# EAGLE design openmv2 (EAGLE 6.1)
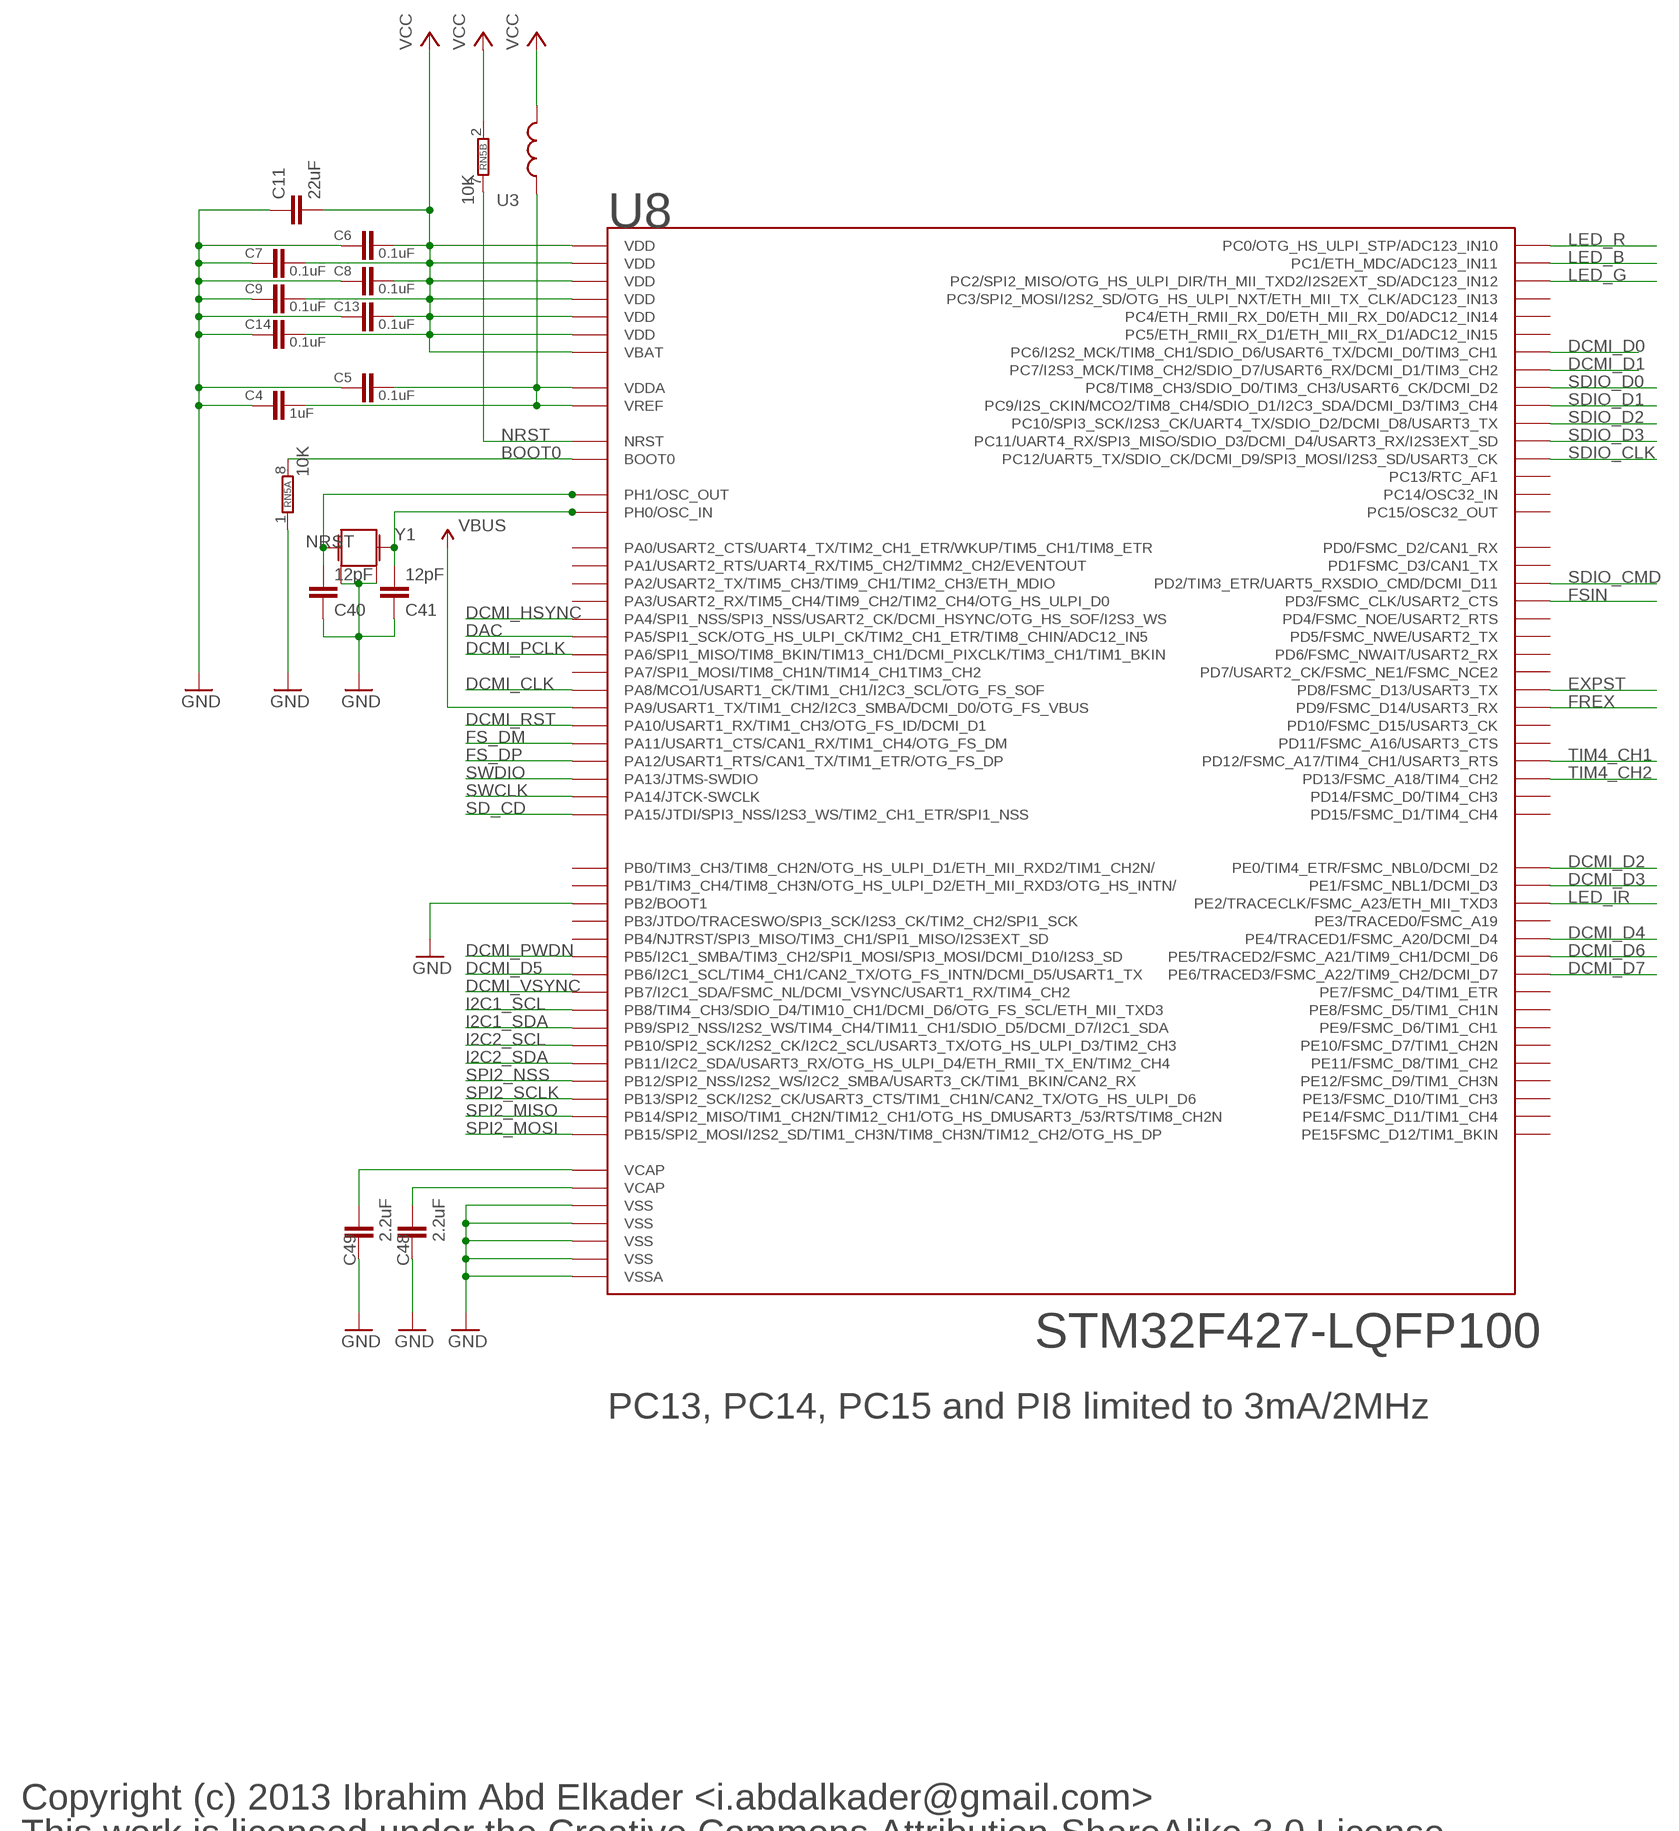
[diagram p0: schematic, sheet 1, part 1 of 2]
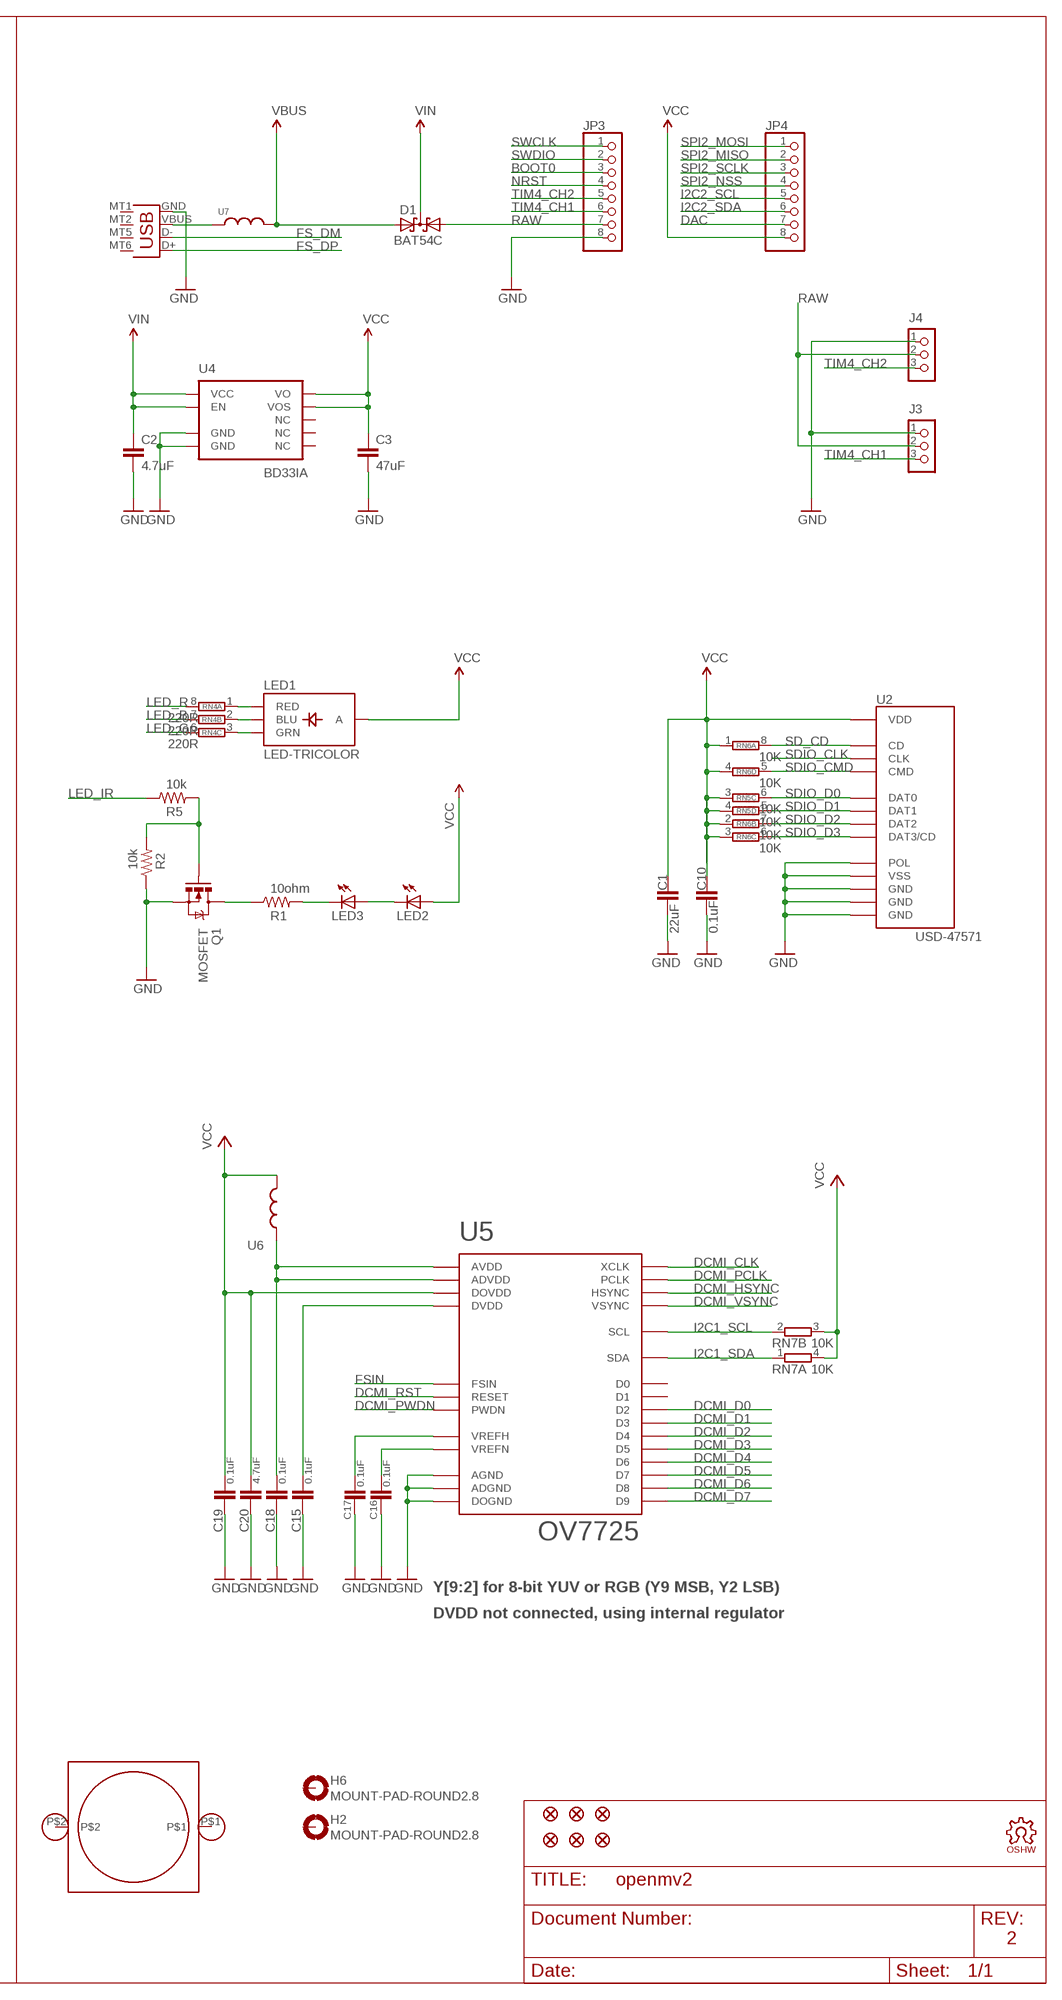
[diagram p1: schematic, sheet 1, part 2 of 2]

## Parts
C1  22uF  CAP0805  [0805]
C2  4.7uF  CAP0603-CAP  [0603-CAP]
C3  47uF  CAP1206  [1206]
C4  1uF  CAP0603-CAP  [0603-CAP]
C5  0.1uF  CAP0603-CAP  [0603-CAP]
C6  0.1uF  CAP0603-CAP  [0603-CAP]
C7  0.1uF  CAP0603-CAP  [0603-CAP]
C8  0.1uF  CAP0603-CAP  [0603-CAP]
C9  0.1uF  CAP0603-CAP  [0603-CAP]
C10  0.1uF  CAP0603-CAP  [0603-CAP]
C11  22uF  CAP0805  [0805]
C13  0.1uF  CAP0603-CAP  [0603-CAP]
C14  0.1uF  CAP0603-CAP  [0603-CAP]
C15  0.1uF  CAP0603-CAP  [0603-CAP]
C16  0.1uF  CAP0603-CAP  [0603-CAP]
C17  0.1uF  CAP0603-CAP  [0603-CAP]
C18  0.1uF  CAP0603-CAP  [0603-CAP]
C19  0.1uF  CAP0603-CAP  [0603-CAP]
C20  4.7uF  CAP0603-CAP  [0603-CAP]
C40  12pF  CAP0603-CAP  [0603-CAP]
C41  12pF  CAP0603-CAP  [0603-CAP]
C48  2.2uF  CAP0603-CAP  [0603-CAP]
C49  2.2uF  CAP0603-CAP  [0603-CAP]
D1  BAT54C  [SOT23]
H2  MOUNT-PAD-ROUND2.8  [2,8-PAD]
H6  MOUNT-PAD-ROUND2.8  [2,8-PAD]
J3  CON_HEADER_1X03  [M1X3_SMD]
J4  CON_HEADER_1X03  [M1X3_SMD]
JP1  FIDUCIAL1X2  [FIDUCIAL-1X2]
JP2  FIDUCIAL1X2  [FIDUCIAL-1X2]
JP3  PINHD-1X8  [1X08]
JP4  PINHD-1X8  [1X08]
JP5  FIDUCIAL1X2  [FIDUCIAL-1X2]
JP6  FIDUCIAL1X2  [FIDUCIAL-1X2]
JP7  FIDUCIAL1X2  [FIDUCIAL-1X2]
JP8  FIDUCIAL1X2  [FIDUCIAL-1X2]
LED1  LED-TRICOLOR  [LED-TRICOLOR-SMD]
LED2  LED3MM  [LED3MM]
LED3  LED3MM  [LED3MM]
LOGO1  OSHW_LOGO_FILLX0150-NT  [OSHW_FILLX150_NOTEXT]
Q1  MOSFET  MOSFET-NCHANNELSMD  [SOT23-3]
R1  10ohm  RESISTOR0603-RES  [0603-RES]
R2  10k  RESISTOR0603-RES  [0603-RES]
R5  10k  RESISTOR0603-RES  [0603-RES]
RN4  220R  4R-NEXBV8V  [EXBV8V]
RN5  10K  4R-NEXBV8V  [EXBV8V]
RN6  10K  4R-NEXBV8V  [EXBV8V]
RN7  10K  2R-NEXBV4V  [EXBV4V]
U1  LENSMOUNT20MM  [LENSMOUNT-20MM]
U2  USD-47571  [USD-47571]
U3  INDUCTOR0603  [0603]
U4  BD33IA  [HTSOP-J8]
U5  OV7725  [CSP2-28]
U6  INDUCTOR0603  [0603]
U7  INDUCTOR0603  [0603]
U8  STM32F427-LQFP100  STM32F407LQFP100  [LQFP100]
X2  USB-MICROB  [USB-MICROB]
Y1  CRYSTAL2.5X2.0  [CRYSTAL-2.5X2.0]

## Nets
BOOT0: JP3.3 RN5.8 U8.94(BOOT0)
DAC: JP4.7 U8.30(PA5/SPI1_SCK/OTG_HS_ULPI_CK/TIM2_CH1_ETR/TIM8_CHIN/ADC12_IN5)
DCMI_CLK: U5.F3(XCLK) U8.67(PA8/MCO1/USART1_CK/TIM1_CH1/I2C3_SCL/OTG_FS_SOF)
DCMI_D0: U5.F5(D2) U8.63(PC6/I2S2_MCK/TIM8_CH1/SDIO_D6/USART6_TX/DCMI_D0/TIM3_CH1)
DCMI_D1: U5.F2(D3) U8.64(PC7/I2S3_MCK/TIM8_CH2/SDIO_D7/USART6_RX/DCMI_D1/TIM3_CH2)
DCMI_D2: U5.D6(D4) U8.97(PE0/TIM4_ETR/FSMC_NBL0/DCMI_D2)
DCMI_D3: U5.D1(D5) U8.98(PE1/FSMC_NBL1/DCMI_D3)
DCMI_D4: U5.E6(D6) U8.3(PE4/TRACED1/FSMC_A20/DCMI_D4)
DCMI_D5: U5.E1(D7) U8.92(PB6/I2C1_SCL/TIM4_CH1/CAN2_TX/OTG_FS_INTN/DCMI_D5/USART1_TX)
DCMI_D6: U5.F6(D8) U8.4(PE5/TRACED2/FSMC_A21/TIM9_CH1/DCMI_D6)
DCMI_D7: U5.F1(D9) U8.5(PE6/TRACED3/FSMC_A22/TIM9_CH2/DCMI_D7)
DCMI_HSYNC: U5.B6(HSYNC) U8.29(PA4/SPI1_NSS/SPI3_NSS/USART2_CK/DCMI_HSYNC/OTG_HS_SOF/I2S3_WS)
DCMI_PCLK: U5.E4(PCLK) U8.31(PA6/SPI1_MISO/TIM8_BKIN/TIM13_CH1/DCMI_PIXCLK/TIM3_CH1/TIM1_BKIN)
DCMI_PWDN: U5.C1(PWDN) U8.91(PB5/I2C1_SMBA/TIM3_CH2/SPI1_MOSI/SPI3_MOSI/DCMI_D10/I2S3_SD)
DCMI_RST: U5.A2(RESET) U8.69(PA10/USART1_RX/TIM1_CH3/OTG_FS_ID/DCMI_D1)
DCMI_VSYNC: U5.C6(VSYNC) U8.93(PB7/I2C1_SDA/FSMC_NL/DCMI_VSYNC/USART1_RX/TIM4_CH2)
EXPST: U8.55(PD8/FSMC_D13/USART3_TX)
FREX: U8.56(PD9/FSMC_D14/USART3_RX)
FS_DM: U8.70(PA11/USART1_CTS/CAN1_RX/TIM1_CH4/OTG_FS_DM) X2.D-
FS_DP: U8.71(PA12/USART1_RTS/CAN1_TX/TIM1_ETR/OTG_FS_DP) X2.D+
FSIN: U5.A4(FSIN) U8.84(PD3/FSMC_CLK/USART2_CTS)
GND: C1.2 C2.2 C3.2 C4.2 C5.2 C6.2 C7.2 C8.2 C9.2 C10.2 C11.1 C13.2 C14.2 C15.2 C16.2 C17.2 C18.2 C19.2 C20.2 C40.1 C41.1 C48.2 C49.2 J3.1 J4.1 JP3.8 Q1.2(S) R2.1 RN5.1 U2.G$1(GND) U2.G$2(GND) U2.G$3(GND) U2.G$4(POL) U2.P$6(VSS) U4.3(GND) U4.P$1(GND) U5.B1(ADGND) U5.B4(AGND) U5.F4(DOGND) U8.10(VSS) U8.20(VSSA) U8.27(VSS) U8.37(PB2/BOOT1) U8.74(VSS) U8.99(VSS) X2.GND Y1.2 Y1.4
I2C1_SCL: RN7.2 U5.A5(SCL) U8.95(PB8/TIM4_CH3/SDIO_D4/TIM10_CH1/DCMI_D6/OTG_FS_SCL/ETH_MII_TXD3)
I2C1_SDA: RN7.1 U5.B5(SDA) U8.96(PB9/SPI2_NSS/I2S2_WS/TIM4_CH4/TIM11_CH1/SDIO_D5/DCMI_D7/I2C1_SDA)
I2C2_SCL: JP4.5 U8.47(PB10/SPI2_SCK/I2S2_CK/I2C2_SCL/USART3_TX/OTG_HS_ULPI_D3/TIM2_CH3)
I2C2_SDA: JP4.6 U8.48(PB11/I2C2_SDA/USART3_RX/OTG_HS_ULPI_D4/ETH_RMII_TX_EN/TIM2_CH4)
LED_B: RN4.7 U8.16(PC1/ETH_MDC/ADC123_IN11)
LED_G: RN4.6 U8.17(PC2/SPI2_MISO/OTG_HS_ULPI_DIR/TH_MII_TXD2/I2S2EXT_SD/ADC123_IN12)
LED_IR: R5.1 U8.1(PE2/TRACECLK/FSMC_A23/ETH_MII_TXD3)
LED_R: RN4.8 U8.15(PC0/OTG_HS_ULPI_STP/ADC123_IN10)
N$1: C17.1 U5.A3(VREFH)
N$2: C40.2 U8.13(PH1/OSC_OUT) Y1.3
N$3: C16.1 U5.B2(VREFN)
N$4: C41.2 U8.12(PH0/OSC_IN) Y1.1
N$5: Q1.1(G) R2.2 R5.2
N$7: U7.1 X2.VBUS
N$8: LED1.R(RED) RN4.1
N$9: LED1.G(GRN) RN4.3
N$10: LED3.K(C) R1.2
N$11: LED1.B(BLU) RN4.2
N$12: C4.1 C5.1 U3.1 U8.21(VREF) U8.22(VDDA)
N$13: C18.1 U5.A1(ADVDD) U5.B3(AVDD) U6.1
N$14: Q1.3(D) R1.1
N$15: C15.1 U5.E3(DVDD)
N$16: LED2.K(C) LED3.A
NRST: JP3.4 RN5.7 U8.14(NRST)
RAW: D1.1(A1) J3.2 J4.2 JP3.7
SD_CD: RN6.8 U2.G$5(CD) U8.77(PA15/JTDI/SPI3_NSS/I2S3_WS/TIM2_CH1_ETR/SPI1_NSS)
SDIO_CLK: U2.P$5(CLK) U8.80(PC12/UART5_TX/SDIO_CK/DCMI_D9/SPI3_MOSI/I2S3_SD/USART3_CK)
SDIO_CMD: RN6.5 U2.P$3(CMD) U8.83(PD2/TIM3_ETR/UART5_RXSDIO_CMD/DCMI_D11)
SDIO_D0: RN5.6 U2.P$7(DAT0) U8.65(PC8/TIM8_CH3/SDIO_D0/TIM3_CH3/USART6_CK/DCMI_D2)
SDIO_D1: RN5.5 U2.P$8(DAT1) U8.66(PC9/I2S_CKIN/MCO2/TIM8_CH4/SDIO_D1/I2C3_SDA/DCMI_D3/TIM3_CH4)
SDIO_D2: RN6.7 U2.P$1(DAT2) U8.78(PC10/SPI3_SCK/I2S3_CK/UART4_TX/SDIO_D2/DCMI_D8/USART3_TX)
SDIO_D3: RN6.6 U2.P$2(DAT3/CD) U8.79(PC11/UART4_RX/SPI3_MISO/SDIO_D3/DCMI_D4/USART3_RX/I2S3EXT_SD)
SPI2_MISO: JP4.2 U8.53(PB14/SPI2_MISO/TIM1_CH2N/TIM12_CH1/OTG_HS_DMUSART3_/53/RTS/TIM8_CH2N)
SPI2_MOSI: JP4.1 U8.54(PB15/SPI2_MOSI/I2S2_SD/TIM1_CH3N/TIM8_CH3N/TIM12_CH2/OTG_HS_DP)
SPI2_NSS: JP4.4 U8.51(PB12/SPI2_NSS/I2S2_WS/I2C2_SMBA/USART3_CK/TIM1_BKIN/CAN2_RX)
SPI2_SCLK: JP4.3 U8.52(PB13/SPI2_SCK/I2S2_CK/USART3_CTS/TIM1_CH1N/CAN2_TX/OTG_HS_ULPI_D6)
SWCLK: JP3.1 U8.76(PA14/JTCK-SWCLK)
SWDIO: JP3.2 U8.72(PA13/JTMS-SWDIO)
TIM4_CH1: J3.3 JP3.6 U8.59(PD12/FSMC_A17/TIM4_CH1/USART3_RTS)
TIM4_CH2: J4.3 JP3.5 U8.60(PD13/FSMC_A18/TIM4_CH2)
VBUS: D1.2(A2) U7.2 U8.68(PA9/USART1_TX/TIM1_CH2/I2C3_SMBA/DCMI_D0/OTG_FS_VBUS)
VCAP1: C49.1 U8.49(VCAP)
VCAP2: C48.1 U8.73(VCAP)
VCC: C1.1 C3.1 C6.1 C7.1 C8.1 C9.1 C10.1 C11.2 C13.1 C14.1 C19.1 C20.1 JP4.8 LED1.A LED2.A RN5.2 RN5.3 RN5.4 RN6.1 RN6.2 RN6.3 RN6.4 RN7.3 RN7.4 U2.P$4(VDD) U3.2 U4.1(VO) U4.2(VOS) U5.E5(DOVDD) U6.2 U8.6(VBAT) U8.11(VDD) U8.19(VDD) U8.28(VDD) U8.50(VDD) U8.75(VDD) U8.100(VDD)
VIN: C2.1 D1.3(CC) U4.5(EN) U4.8(VCC)
Unconnected: H2.B2,8(MOUNT) H6.B2,8(MOUNT) RN4.4 RN4.5 U1.P$1 U1.P$2 U4.4(NC) U4.6(NC) U4.7(NC) U5.A6(D0) U5.E2(D1) U8.2(PE3/TRACED0/FSMC_A19) U8.7(PC13/RTC_AF1) U8.8(PC14/OSC32_IN) U8.9(PC15/OSC32_OUT) U8.18(PC3/SPI2_MOSI/I2S2_SD/OTG_HS_ULPI_NXT/ETH_MII_TX_CLK/ADC123_IN13) U8.23(PA0/USART2_CTS/UART4_TX/TIM2_CH1_ETR/WKUP/TIM5_CH1/TIM8_ETR) U8.24(PA1/USART2_RTS/UART4_RX/TIM5_CH2/TIMM2_CH2/EVENTOUT) U8.25(PA2/USART2_TX/TIM5_CH3/TIM9_CH1/TIM2_CH3/ETH_MDIO) U8.26(PA3/USART2_RX/TIM5_CH4/TIM9_CH2/TIM2_CH4/OTG_HS_ULPI_D0) U8.32(PA7/SPI1_MOSI/TIM8_CH1N/TIM14_CH1TIM3_CH2) U8.33(PC4/ETH_RMII_RX_D0/ETH_MII_RX_D0/ADC12_IN14) U8.34(PC5/ETH_RMII_RX_D1/ETH_MII_RX_D1/ADC12_IN15) U8.35(PB0/TIM3_CH3/TIM8_CH2N/OTG_HS_ULPI_D1/ETH_MII_RXD2/TIM1_CH2N/) U8.36(PB1/TIM3_CH4/TIM8_CH3N/OTG_HS_ULPI_D2/ETH_MII_RXD3/OTG_HS_INTN/) U8.38(PE7/FSMC_D4/TIM1_ETR) U8.39(PE8/FSMC_D5/TIM1_CH1N) U8.40(PE9/FSMC_D6/TIM1_CH1) U8.41(PE10/FSMC_D7/TIM1_CH2N) U8.42(PE11/FSMC_D8/TIM1_CH2) U8.43(PE12/FSMC_D9/TIM1_CH3N) U8.44(PE13/FSMC_D10/TIM1_CH3) U8.45(PE14/FSMC_D11/TIM1_CH4) U8.46(PE15FSMC_D12/TIM1_BKIN) U8.57(PD10/FSMC_D15/USART3_CK) U8.58(PD11/FSMC_A16/USART3_CTS) U8.61(PD14/FSMC_D0/TIM4_CH3) U8.62(PD15/FSMC_D1/TIM4_CH4) U8.81(PD0/FSMC_D2/CAN1_RX) U8.82(PD1FSMC_D3/CAN1_TX) U8.85(PD4/FSMC_NOE/USART2_RTS) U8.86(PD5/FSMC_NWE/USART2_TX) U8.87(PD6/FSMC_NWAIT/USART2_RX) U8.88(PD7/USART2_CK/FSMC_NE1/FSMC_NCE2) U8.89(PB3/JTDO/TRACESWO/SPI3_SCK/I2S3_CK/TIM2_CH2/SPI1_SCK) U8.90(PB4/NJTRST/SPI3_MISO/TIM3_CH1/SPI1_MISO/I2S3EXT_SD) X2.MT1(GND1) X2.MT2(GND2) X2.MT5(GND3) X2.MT6(GND4)

## Notes on the sheet
- Y[9:2] for 8-bit YUV or RGB (Y9 MSB, Y2 LSB)
- PC13, PC14, PC15 and PI8 limited to 3mA/2MHz
- DVDD not connected, using internal regulator
- Copyright (c) 2013 Ibrahim Abd Elkader <i.abdalkader@gmail.com>
- This work is licensed under the Creative Commons Attribution-ShareAlike 3.0 License.
- To view a copy of this license, visit http://creativecommons.org/licenses/by-sa/3.0/ | 2

## Library data of the parts
C1-C11 C13-C20 C40 C41 C48 C49 = sfe:CAP: Capacitor Standard 0603 ceramic capacitor, and 0.1" leaded capacitor.
D1 = diode:BAT54C: Schottky Diodes Source: Fairchild .. BAT54.pdf
H2 H6 = holes:MOUNT-PAD-ROUND: MOUNTING PAD, round
J3 J4 = dp_devices:CON_HEADER_1X03
JP1 JP2 JP5-JP8 = sfe:FIDUCIAL: Fiducial Alignment Points Various fiducial points for machine vision alignment.
JP3 JP4 = pinhead:PINHD-1X8: PIN HEADER
LED1 = sfe:LED-TRICOLOR: Tri-Color LED SMD Proven layout and schematic for triple color LED in SMD package - common anode. Spark Fun Electronics SKU : COM-07844
LED2 LED3 = sfe:LED: LEDs Standard schematic elements and footprints for 5mm, 3mm, 1206, and 0603 sized LEDs. 5mm - Spark Fun Electronics SKU : COM-00529 (and others)
LOGO1 = iofault:OSHW_LOGO_FILL
Q1 = sfe:MOSFET-NCHANNEL
R1 R2 R5 = sfe:RESISTOR: Resistor Basic schematic elements and footprints for 0603, 1206, and PTH resistors.
RN4-RN6 = resistor-dil:4R-N: Array Chip Resistor Source: RS Component / Phycomp; OC_FARNELL: unknown; OC_NEWARK: unknown
RN7 = resistor-dil:2R-N: Array Chip Resistor Source: Panasonic; OC_FARNELL: unknown; OC_NEWARK: unknown
U1 = omnivision:LENSMOUNT
U2 = mux:USD-47571
U3 U6 U7 = sfe:INDUCTOR: Inductors Basic Inductor/Choke - 0603 and 1206. Footprints are not proven and vary greatly between part numbers.
U4 = mux:BD33IA
U5 = omnivision:OV7725
U8 = mux:STM32F407
X2 = sfe:USB: USB Connectors USB-B-PTH is fully proven SKU : PRT-00139 USB-miniB is fully proven SKU : PRT-00587 USB-A-PCB is untested. USB-A-H is throughly reviewed, but untested. Spark Fun Electronics SKU : PRT-00437 USB-B-SMT is throughly reviewed, but untested. Needs silkscreen touching up. USB-A-S has not been used/tested USB-MB-H has not been used/tested
Y1 = mux:CRYSTAL: Crystals Various standard crystals. Proven footprints. Spark Fun Electronics SKU : COM-00534

## Board
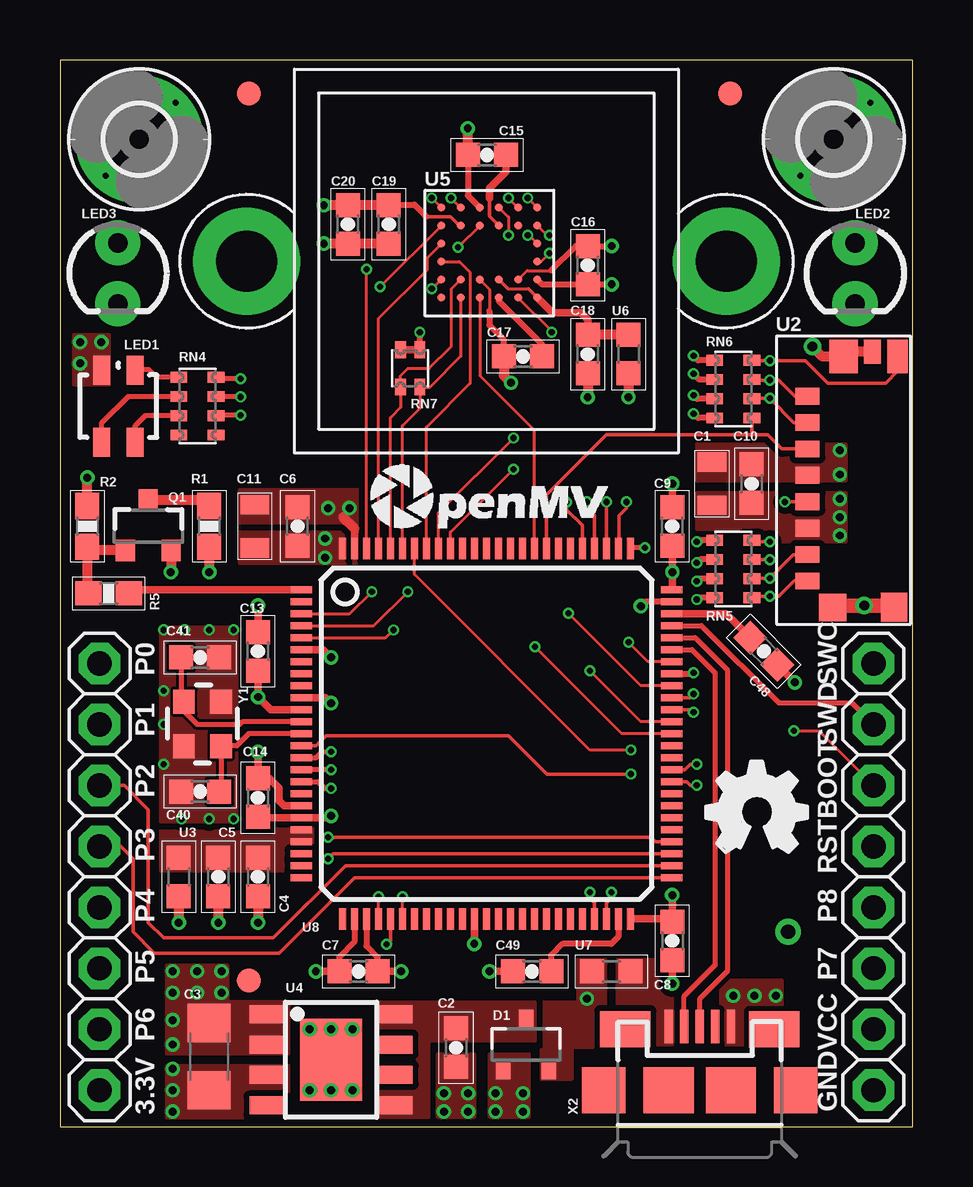
[diagram p2: board, top side]
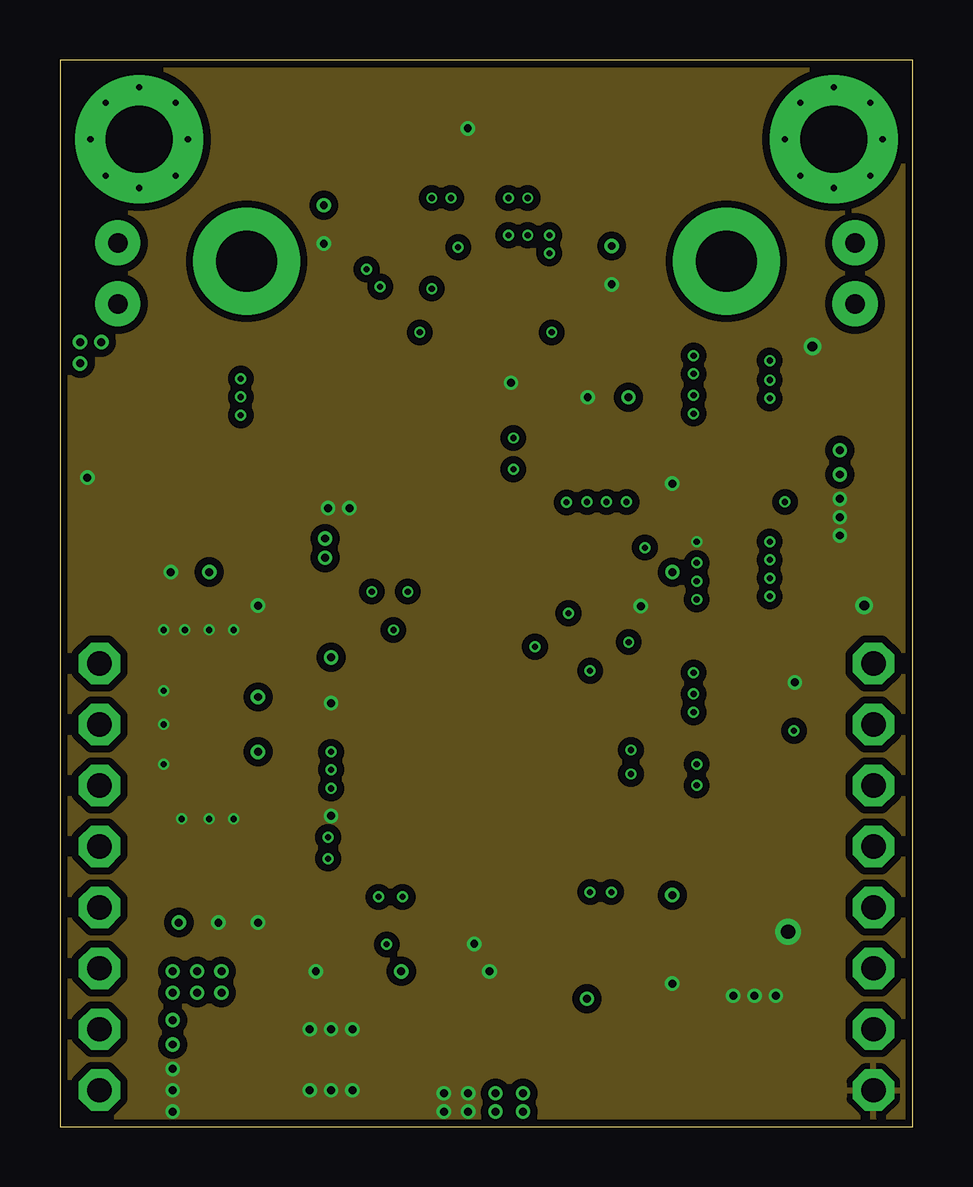
[diagram p3: board, inner layer GND]
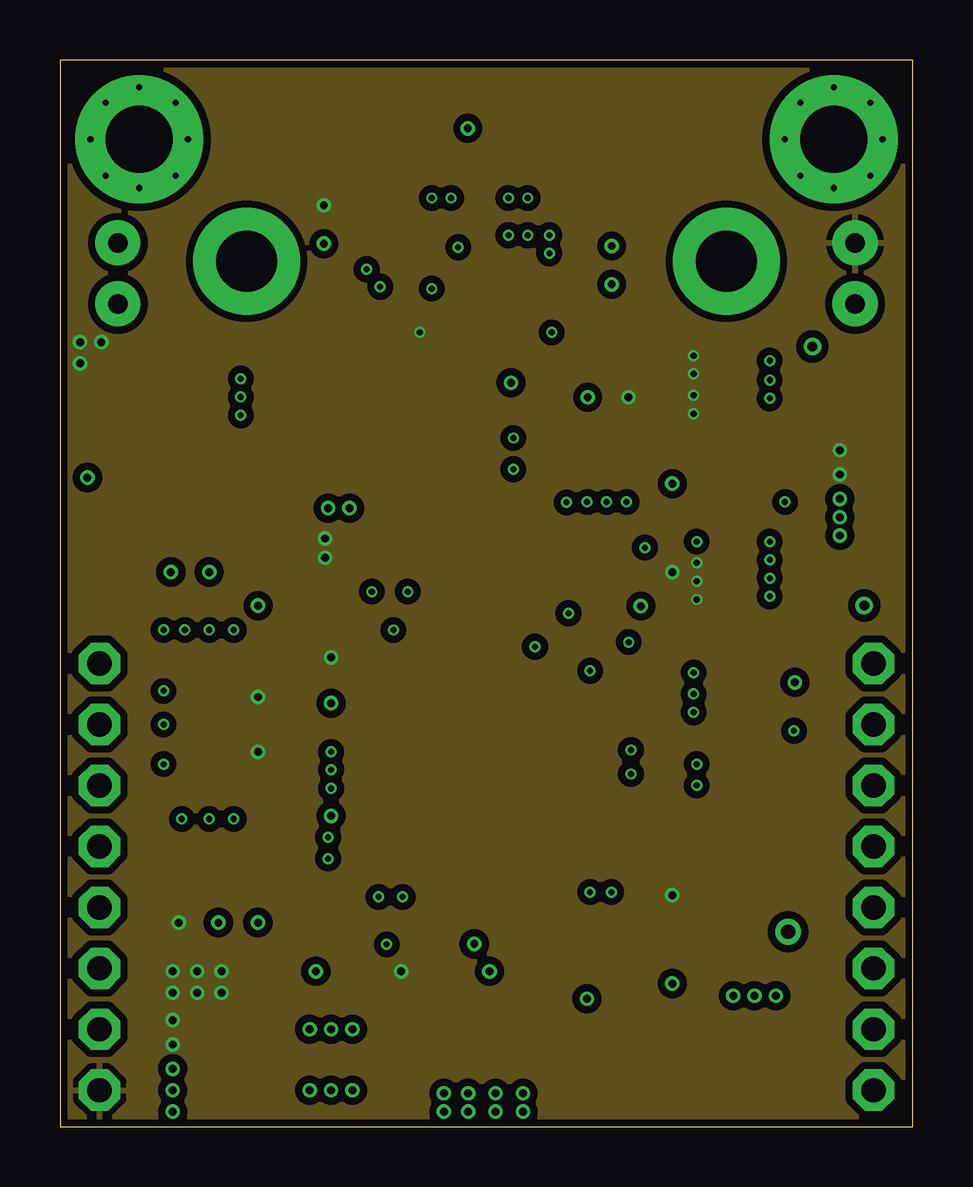
[diagram p4: board, inner layer VCC]
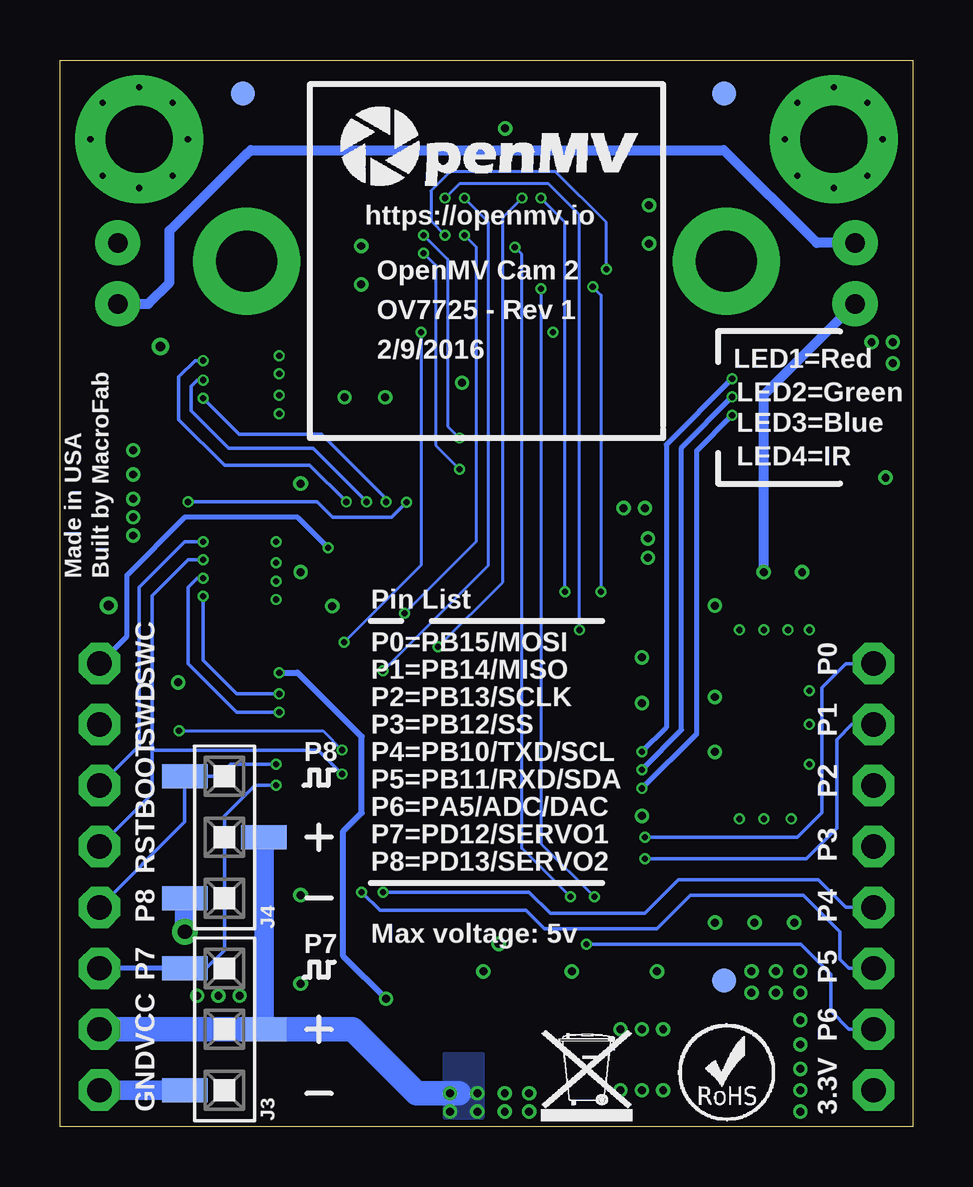
[diagram p5: board, bottom side, seen from below]

Size 35.56 x 44.45 mm. Coordinates in mm from the lower left corner, seen from the top.
Outline: 0,44.45 0,0 35.56,0 35.56,44.45 0,44.45
Copper layers (1*2+15*16): Top 0.035mm / dielectric 1.5mm / GND 0.035mm / dielectric 0.15mm / VCC 0.035mm / dielectric 0.2mm / Bottom 0.035mm
Design rules: minimum track width 5mil, minimum drill 10mil, track to track 5mil, track to pad 5mil, pad to pad 5mil, via to via 5mil, smd to smd 5mil, copper to edge 5mil, drill to drill 10mil, minimum pad ring 10mil, minimum via ring 4mil, stop-mask expansion 2mil, vias tented up to drill 30mil, thermal gap 10mil

### Footprints (pad centres in the part's own frame; a part is rotated, then mirrored left to right if it is on the bottom)
0805 = smd 0.8 x 1.2: 1 -0.9,0; 2 0.9,0
0603-CAP = smd 1 x 1: 1 -0.8,0; 2 0.8,0
1206 = smd 1.6 x 1.8: 1 -1.4,0; 2 1.4,0
SOT23 = smd 0.6 x 0.7: 1 -0.95,-1.1; 2 0.95,-1.1; 3 0,1.1
2,8-PAD = drill 2.8 pad 5.334: B2,8 0,0
M1X3_SMD = smd 1 x 1.9: 1 -2.54,1.65; 2 0,-1.65; 3 2.54,1.65
FIDUCIAL-1X2 = smd 1 x 1: 1 0,0
1X08 = drill 1.016 octagon: 1 -8.89,0; 2 -6.35,0; 3 -3.81,0; 4 -1.27,0; 5 1.27,0; 6 3.81,0; 7 6.35,0; 8 8.89,0
LED-TRICOLOR-SMD = smd 0.7 x 1.2: A 0.7,-1.5; B 0.7,1.5; G -0.7,1.5; R -0.7,-1.5
LED3MM = drill 0.813 pad 1.88: A -1.27,0; K 1.27,0
SOT23-3 = smd 0.8 x 0.9: 1 -0.95,-1; 2 0.95,-1; 3 0,1.1
0603-RES = smd 1.1 x 1: 1 -0.85,0; 2 0.85,0
EXBV8V = smd 0.45 x 0.7: 1 -1.2,-0.775; 2 -0.4,-0.775; 3 0.4,-0.775; 4 1.2,-0.775; 5 1.2,0.775; 6 0.4,0.775; 7 -0.4,0.775; 8 -1.2,0.775
EXBV4V = smd 0.45 x 0.7: 1 -0.4,-0.775; 2 0.4,-0.775; 3 0.4,0.775; 4 -0.4,0.775
LENSMOUNT-20MM = drill 2.54 pad 4.445: P$1 -10,0; P$2 10,0
USD-47571 = smd 1.15 x 1.15: G$1 -4.9,0.55 | smd 1.2 x 1.1: G$2 -4.9,-2 | smd 1.4 x 1.2: G$3 5.55,0.1 | smd 1 x 0.7: G$4 5.75,-1.1 | smd 1.4 x 0.85: G$5 5.55,-2.15 | smd 0.7 x 1: P$1 3.9,1.6; P$2 2.8,1.6; P$3 1.7,1.6; P$4 0.6,1.6; P$5 -0.5,1.6; P$6 -1.6,1.6; P$7 -2.7,1.6; P$8 -3.8,1.6
0603 = smd 1 x 1: 1 -0.8,0; 2 0.8,0
HTSOP-J8 = smd 0.75 x 1.4: 1 -1.905,-2.7; 2 -0.635,-2.7; 3 0.635,-2.7; 4 1.905,-2.7; 5 1.905,2.7; 6 0.635,2.7; 7 -0.635,2.7; 8 -1.905,2.7 | smd 3.4 x 2.6: P$1 0,0
CSP2-28 = smd 0.34 x 0.34: A1 -2,1.85; A2 -1.2,1.85; A3 -0.4,1.85; A4 0.4,1.85; A5 1.2,1.85; A6 2,1.85; B1 -2,1.1; B2 -1.2,1.1; B3 -0.4,1.1; B4 0.4,1.1; B5 1.2,1.1; B6 2,1.1; C1 -2,0.35; C6 2,0.35; D1 -2,-0.4; D6 2,-0.4; E1 -2,-1.15; E2 -1.2,-1.15; E3 -0.4,-1.15; E4 0.4,-1.15; E5 1.2,-1.15; E6 2,-1.15; F1 -2,-1.9; F2 -1.2,-1.9; F3 -0.4,-1.9; F4 0.4,-1.9; F5 1.2,-1.9; F6 2,-1.9
LQFP100 = smd 0.9 x 0.3: 1 -7.72,6; 2 -7.72,5.5; 3 -7.72,5; 4 -7.72,4.5; 5 -7.72,4; 6 -7.72,3.5; 7 -7.72,3; 8 -7.72,2.5; 9 -7.72,2; 10 -7.72,1.5; 11 -7.72,1; 12 -7.72,0.5; 13 -7.72,0; 14 -7.72,-0.5; 15 -7.72,-1; 16 -7.72,-1.5; 17 -7.72,-2; 18 -7.72,-2.5; 19 -7.72,-3; 20 -7.72,-3.5; 21 -7.72,-4; 22 -7.72,-4.5; 23 -7.72,-5; 24 -7.72,-5.5; 25 -7.72,-6; 51 7.72,-6; 52 7.72,-5.5; 53 7.72,-5; 54 7.72,-4.5; 55 7.72,-4; 56 7.72,-3.5; 57 7.72,-3; 58 7.72,-2.5; 59 7.72,-2; 60 7.72,-1.5; 61 7.72,-1; 62 7.72,-0.5; 63 7.72,0; 64 7.72,0.5; 65 7.72,1; 66 7.72,1.5; 67 7.72,2; 68 7.72,2.5; 69 7.72,3; 70 7.72,3.5; 71 7.72,4; 72 7.72,4.5; 73 7.72,5; 74 7.72,5.5; 75 7.72,6 | smd 0.3 x 0.9: 26 -6,-7.72; 27 -5.5,-7.72; 28 -5,-7.72; 29 -4.5,-7.72; 30 -4,-7.72; 31 -3.5,-7.72; 32 -3,-7.72; 33 -2.5,-7.72; 34 -2,-7.72; 35 -1.5,-7.72; 36 -1,-7.72; 37 -0.5,-7.72; 38 0,-7.72; 39 0.5,-7.72; 40 1,-7.72; 41 1.5,-7.72; 42 2,-7.72; 43 2.5,-7.72; 44 3,-7.72; 45 3.5,-7.72; 46 4,-7.72; 47 4.5,-7.72; 48 5,-7.72; 49 5.5,-7.72; 50 6,-7.72; 76 6,7.72; 77 5.5,7.72; 78 5,7.72; 79 4.5,7.72; 80 4,7.72; 81 3.5,7.72; 82 3,7.72; 83 2.5,7.72; 84 2,7.72; 85 1.5,7.72; 86 1,7.72; 87 0.5,7.72; 88 0,7.72; 89 -0.5,7.72; 90 -1,7.72; 91 -1.5,7.72; 92 -2,7.72; 93 -2.5,7.72; 94 -3,7.72; 95 -3.5,7.72; 96 -4,7.72; 97 -4.5,7.72; 98 -5,7.72; 99 -5.5,7.72; 100 -6,7.72
USB-MICROB = smd 0.35 x 1.4: D+ 0,2.65; D- -0.65,2.65; GND 1.3,2.65; ID 0.65,2.65; VBUS -1.3,2.65 | smd 1.8 x 1.9: MT1 -4,0; MT2 4,0 | smd 2.1 x 1.5: MT3 3.1,2.55; MT4 -3.1,2.55 | smd 2.1 x 1.9: MT5 -1.3,0; MT6 1.3,0
CRYSTAL-2.5X2.0 = smd 1 x 0.9: 1 -0.95,-0.8; 2 0.9,-0.8; 3 0.9,0.75; 4 -0.95,0.75

### Placement (x,y rotation side)
C1  27.18,26.8 270 top
C2  16.51,3.3 270 top
C3  6.22,2.92 270 top
C4  8.26,10.41 270 top
C5  6.6,10.41 270 top
C6  9.91,25.02 90 top
C7  12.45,6.48 180 top
C8  25.53,7.75 270 top
C9  25.53,25.02 90 top
C10  28.83,26.8 270 top
C11  8.13,25.02 270 top
C13  8.26,19.81 90 top
C14  8.26,13.72 270 top
C15  17.8,40.5 180 top
C16  22,35.9 270 top
C17  19.3,32.1 180 top
C18  22,32.2 270 top
C19  13.7,37.6 270 top
C20  12,37.6 270 top
C40  5.84,13.97 0 top
C41  5.84,19.56 180 top
C48  29.34,19.81 315 top
C49  19.68,6.48 180 top
D1  19.43,3.43 0 top
H2  3.3,41.15 90 top
H6  32.26,41.15 270 top
J3  28.7,4.06 90 bottom
J4  28.7,12.06 90 bottom
JP1  7.87,6.1 0 top
JP2  7.87,6.1 0 bottom
JP3  33.91,10.41 270 top
JP4  1.65,10.41 270 top
JP5  7.87,43.05 0 top
JP6  7.87,43.05 0 bottom
JP7  27.94,43.05 0 top
JP8  27.94,43.05 0 bottom
LED1  2.43,30.03 180 top
LED2  33.15,35.56 270 top
LED3  2.41,35.56 270 top
LOGO1  26.92,11.43 0 top
Q1  3.68,25.02 0 top
R1  6.22,25.02 270 top
R2  1.14,25.02 270 top
R5  2.03,22.23 180 top
RN4  5.74,30.03 270 top
RN5  28.07,23.24 270 top
RN6  28.07,30.73 270 top
RN7  14.6,31.6 0 top
U1  17.78,36.07 0 top
U2  32.77,26.54 90 top
U3  4.95,10.41 270 top
U4  11.3,2.79 270 top
U5  17.9,36.4 180 top
U6  23.7,32.2 270 top
U7  22.99,6.48 180 top
U8  17.78,16.38 0 top
U$1  [WEEE]  15.49,0.25 0 bottom
U$2  [ROHS]  9.78,0.25 0 bottom
U$3  [OMV-LOGO]  24,38.99 0 bottom
U$4  [OMV-LOGO-SMALL]  12.83,24.77 0 top
X2  26.67,1.52 0 top
Y1  5.97,16.76 270 top

### Tracks (layer width: path | path; a pad name or v marks a point on that pad's centre or on a via)
BOOT0  (via drill 0.25)
  Top 0.127: v30.6,16.5 31.63,16.5 JP3.3 | U8.94 14.78,23.02 22.1,15.7 v23.8,15.7
  Top 0.152: v29.59,24.38 28.9,24.38 RN5.8
  Bottom 0.127: v30.6,16.5 24.6,16.5 v23.8,15.7
  Bottom 0.152: v29.59,24.38 30.35,24.38 32.26,22.48 32.26,15.88 JP3.3
DAC  (via drill 0.25)
  Top 0.152: U8.30 13.78,7.76 v13.62,7.6
  Bottom 0.152: v13.62,7.6 4.68,7.6 3.43,6.35 3.43,4.83 2.67,4.06 JP4.7
DCMI_CLK  (via drill 0.25)
  Top 0.127: U5.F3 18.35,38.3 18.35,38.25 18.7,37.9 v18.7,37.15 | U8.67 24.22,18.38 v21.2,21.4
  Bottom 0.127: v21.2,21.4 18.2,24.4 18.2,36.65 v18.7,37.15
DCMI_D0  (via drill 0.25)
  Top 0.127: v19.8,20 23.42,16.38 U8.63 | U5.F5 v16.3,38.7
  Bottom 0.127: v19.8,20 17.1,22.7 17.1,37.9 v16.3,38.7
DCMI_D1  (via drill 0.25)
  Top 0.127: U8.64 24.22,16.88 v22.1,19 | U5.F2 v18.7,38.7
  Top 0.152: U8.64 arc-90 U8.64
  Bottom 0.127: v22.1,19 17.7,23.4 17.7,37.7 v18.7,38.7
DCMI_D2
  Top 0.127: U8.97 13.28,33.68 15.3,35.7 15.3,36.2 U5.D6
DCMI_D3  (via drill 0.25)
  Top 0.127: U8.98 v12.78,35.73 | v19.5,37.15 19.55,37.15 U5.D1
  Bottom 0.127: v12.78,35.73 12.78,37.68 14.9,39.8 19.3,39.8 20.1,39 20.1,37.75 v19.5,37.15
DCMI_D4  (via drill 0.25)
  Top 0.127: U8.3 12.08,21.38 v13,22.3 | U5.E6 v13.35,35
  Bottom 0.127: v13,22.3 13,34.65 v13.35,35
DCMI_D5  (via drill 0.25)
  Top 0.127: v20.4,37.15 20.3,37.15 U5.E1 | U8.92 15.78,25.58 v18.9,28.7
  Bottom 0.127: v20.4,37.15 19.4,36.15 19.4,29.2 v18.9,28.7
DCMI_D6  (via drill 0.25)
  Top 0.127: U5.F6 v15.5,38.7 | U8.4 13.08,20.88 v14.5,22.3
  Bottom 0.127: v14.5,22.3 14.5,37.7 v15.5,38.7
DCMI_D7  (via drill 0.25)
  Top 0.127: 19.95,38.3 U5.F1 v19.5,38.7 | U8.5 13.58,20.38 v13.9,20.7
  Bottom 0.127: v19.5,38.7 18.9,39.3 15.2,39.3 13.9,38 v13.9,20.7
DCMI_HSYNC  (via drill 0.25)
  Top 0.127: U8.29 v13.28,9.58 | U5.B6 15.88,35.3 v15.5,34.92
  Bottom 0.127: v15.5,34.92 15.5,11.8 v13.28,9.58
DCMI_PCLK  (via drill 0.25)
  Top 0.127: 17.5,37.56 U5.E4 v16.6,36.65 | U8.31 v14.28,9.58
  Bottom 0.127: v14.28,9.58 16.3,11.6 16.3,36.35 v16.6,36.65
DCMI_PWDN  (via drill 0.25)
  Top 0.127: U5.C1 20.05,36.05 v20.4,36.4 | v18.9,27.4 16.28,24.78 U8.91
  Bottom 0.127: v20.4,36.4 19.9,35.9 19.9,28.4 v18.9,27.4
DCMI_RST  (via drill 0.25)
  Top 0.127: U8.69 24.52,19.38 v23.71,20.19 | v20.5,33.1 20.5,33.15 U5.A2
  Bottom 0.127: v23.71,20.19 20.5,23.4 v20.5,33.1
DCMI_VSYNC
  Top 0.127: U5.C6 16.65,36.05 17.1,35.6 17.1,30.97 15.28,29.15 U8.93
FS_DM
  Top 0.203: U8.70 26.34,19.88 27.3,18.92 27.3,6.73 26.02,5.45 X2.D-
FS_DP
  Top 0.203: U8.71 26.48,20.38 27.81,19.05 27.81,6.48 26.67,5.33 X2.D+
FSIN
  Top 0.127: U5.A4 17.5,31.3 19.78,29.02 U8.84
GND  (via drill 0.25, 0.33, 0.33 pad 0.61, 0.41, 0.6)
  Top 0.127: U5.B4 17.9,34.9 17.9,34
  Top 0.254: RN5.1 26.6,24.44 v26.54,24.38 | U8.27 12.28,7.71 11.65,7.07 C7.2 | U5.F4 17,38.8 C15.2 | v23,35.1 C16.2 20.1,35.1 U5.B1 | U8.74 24.4,21.88 v24.21,21.7 | 17.9,34 17.9,33.4 18.5,32.8 C17.2
  Top 0.305: C48.2 v30.63,18.52 | U8.99 12.28,24.93 | C7.2 v10.67,6.48 | C49.2 v17.91,6.48 | C9.2 v25.53,26.8 | C14.2 8.29,12.88 U8.20 11.23,12.88 v11.3,12.95 | C8.2 v25.53,5.97 | U8.10 11.07,17.88 v11.3,17.65 | C13.2 v8.26,21.72 | U8.37 v17.28,7.63 v17.27,7.62
  Top 0.406: U2.P$6 31.24,25.02 | U2.G$4 32.87,32.29 U2.G$3 31.79,32.09 v31.37,32.51 | 12.28,24.93 11.81,25.4 | C5.2 v6.6,8.51 | C4.2 v8.26,8.51 | R2.1 v1.14,27.05 | v11,36.8 C20.2 C19.2 | C15.2 v17,41.6 | C18.2 v22,30.4 | Q1.2 4.63,23.12 v4.62,23.11 | C17.2 18.5,31.3 v18.8,31
  Top 0.61: U2.G$2 34.69,21.72 v33.53,21.72 32.29,21.72 arc90 U2.G$1 | U4.P$1 v11.3,1.52
  Bottom 0.813: J3.1 JP3.8 | J4.1 v30.35,8.13
  other vias: 4.32,20.7 4.32,16.76 5.08,12.83 5.21,20.7 7.24,12.83 4.32,18.16 4.32,15.11 17.02,0.64 16,0.64 32.51,24.64 32.51,25.4 29.84,5.46 28.96,5.46 28.07,5.46 16,1.4 17.02,1.4 4.7,0.64 4.7,1.52 4.7,2.41 6.22,12.83 7.24,20.7 6.22,20.7 11.18,25.78 12.06,25.78 32.51,26.16 12.19,4.06 12.19,1.52 10.41,1.52 10.41,4.06 11.3,4.06
  pour GND (isolate 0.305): 0,0 0,44.45 35.56,44.45 35.56,0
  pour Top (isolate 0.254, no thermals): 26.54,26.42 32.77,26.42 32.77,24.38 29.34,24.38 29.34,24.89 26.54,24.89
  pour Top (isolate 0.203, no thermals): 27.56,3.43 27.56,6.1 30.1,6.1 30.1,3.43
  pour Top (isolate 0.254, rank 2, no thermals): 4.45,0.38 4.45,2.54 9.53,2.54 9.53,0.38
  pour Top (isolate 0.254, rank 2, no thermals): 7.49,26.54 12.45,26.54 12.45,23.5 7.49,23.5
  pour Top (no thermals): 4.19,20.83 7.37,20.83 7.37,12.7 4.19,12.7
  pour Top (isolate 0.254, no thermals): 15.75,3.05 17.27,3.05 17.27,0.38 15.75,0.38
I2C1_SCL
  Top 0.127: U8.95 14.28,29.22 15,29.94 RN7.2 15.43,30.82 16.7,32.1 U5.A5
I2C1_SDA
  Top 0.127: U8.96 13.78,29.55 14.2,29.97 RN7.1 14.2,31.3 14.5,31.6 15.39,31.6 16.31,32.51 16.31,34.91 U5.B5
I2C2_SCL  (via drill 0.25)
  Top 0.152: U8.47 22.28,9.34 22.1,9.53 v22.1,9.78
  Bottom 0.152: v22.1,9.78 16,9.78 15.11,8.89 11.18,8.89 9.78,10.29 3.94,10.29 2.79,9.14 JP4.5
I2C2_SDA  (via drill 0.25)
  Top 0.152: U8.48 22.78,9.32 22.99,9.53 v22.99,9.78
  Bottom 0.152: v22.99,9.78 22.23,9.02 16.13,9.02 15.37,8.26 10.67,8.26 9.27,9.65 4.57,9.65 3.05,8.13 3.05,6.99 2.67,6.6 JP4.6
LED_B  (via drill 0.25)
  Top 0.203: v7.54,30.41 6.53,30.41 RN4.7 | v11.3,14.88 U8.16
  Bottom 0.203: v11.3,14.88 9.65,16.53 9.65,28.3 v7.54,30.41
LED_G  (via drill 0.25)
  Top 0.203: U8.17 10.76,14.38 11.05,14.1 v11.3,14.1 | v7.54,29.65 6.53,29.65 RN4.6
  Bottom 0.203: v11.3,14.1 9.02,16.38 9.02,28.17 v7.54,29.65
LED_IR
  Top 0.305: U8.1 3.04,22.38 R5.1
LED_R  (via drill 0.25)
  Top 0.203: v7.54,31.17 6.57,31.17 RN4.8 | U8.15 10.68,15.38 10.92,15.62 v11.3,15.62
  Bottom 0.203: v11.3,15.62 10.29,16.64 10.29,28.42 v7.54,31.17
N$1
  Top 0.254: U5.A3 18.3,34.4 20.1,32.6 C17.1
N$2
  Top 0.203: C40.2 arc90 6.72,14.05 Y1.3 6.73,15.88 7.37,15.88 7.87,16.38 U8.13
N$3  (via drill 0.33)
  Top 0.127: U5.B2 19.48,35.67 20.48,35.67
  Top 0.254: 20.48,35.67 21.5,36.7 C16.1 v23,36.7
N$4
  Top 0.203: C41.2 5.04,17.71 Y1.1 5.17,17.31 5.71,16.76 7.49,16.76 7.62,16.89 U8.12
N$5
  Top 0.406: R5.2 1.14,22.26 R2.2 1.29,24.02 Q1.1
N$6  (via drill 0.25)
  other vias: 3.3,43.31
N$7
  pour Top (isolate 0.254, no thermals): 25.53,6.96 23.24,6.96 23.24,3.43 25.53,3.43
N$8
  Top 0.203: RN4.1 4.03,31.23 3.7,31.55 3.16,31.55 LED1.R
N$9
  Top 0.203: RN4.3 3.56,29.63 3.13,29.2 LED1.G
N$10  (via drill 0.33 pad 0.61)
  Top 0.406: R1.2 v6.22,23.11
  Bottom 0.406: LED3.K 2.43,34.29 6.22,30.49 v6.22,23.11
N$11
  Top 0.203: RN4.2 2.83,30.43 1.73,29.33 LED1.B
N$12
  pour Top (isolate 0.254, rank 2, no thermals): 4.19,12.45 10.54,12.45 10.54,10.67 4.19,10.67
N$13
  Top 0.127: 18.68,34.92 19.52,34.92
  Top 0.152: U5.B3 18.68,34.92 | 19.52,34.92 U5.A1
  Top 0.305: C18.1 22,33.63 21.72,33.91 20.54,33.91 U5.A1
  Top 0.406: U6.1 C18.1
N$14
  Top 0.406: Q1.3 5.97,26.12 R1.1
N$15
  Top 0.152: 17.9,38.7 17.9,37.95 U5.E3
  Top 0.305: 17.9,38.7 17.9,39.1 18.6,39.8 C15.1
N$16
  Bottom 0.406: LED3.A 4.02,36.83 7.89,40.7 27.6,40.7 27.81,40.49 27.84,40.49 30.99,37.34 30.99,35.18 31.88,34.29 LED2.K
N$17  (via drill 0.25)
  other vias: 5.33,41.15
N$18  (via drill 0.25)
  other vias: 3.3,39.12
N$19  (via drill 0.25)
  other vias: 1.27,41.15
N$38  (via drill 0.25)
  other vias: 1.91,39.62
N$39  (via drill 0.25)
  other vias: 4.83,39.62
N$40  (via drill 0.25)
  other vias: 1.91,42.67
N$41  (via drill 0.25)
  other vias: 4.83,42.67
N$42  (via drill 0.25)
  other vias: 32.26,43.31
N$43  (via drill 0.25)
  other vias: 34.29,41.15
N$44  (via drill 0.25)
  other vias: 32.26,39.12
N$45  (via drill 0.25)
  other vias: 30.23,41.15
N$46  (via drill 0.25)
  other vias: 33.78,42.67
N$47  (via drill 0.25)
  other vias: 30.86,42.67
N$48  (via drill 0.25)
  other vias: 33.78,39.62
N$49  (via drill 0.25)
  other vias: 30.86,39.62
NRST  (via drill 0.25)
  Top 0.152: U8.14 10.68,15.88 11.09,16.3 18.7,16.3 20.3,14.7 v23.8,14.7 | 28.86,23.62 v29.59,23.62
  Top 0.203: 28.86,23.62 RN5.7
  Bottom 0.152: 31.73,15.7 31.73,22.12 30.23,23.62 v29.59,23.62 | JP3.4 31.73,13.87 31.73,15.7 | v23.8,14.7 24.8,15.7 31.73,15.7
RAW  (via drill 0.33)
  Bottom 0.61: J3.2
  Bottom 0.813: J3.2 J4.2
  Bottom 1.016: JP3.7 J3.2 23.37,4.06 20.7,1.4 18.92,1.4
  other vias: 19.3,0.64 19.3,1.4 18.16,1.4 18.16,0.64
  pour Top (isolate 0.254, rank 2, no thermals): 17.91,3.05 19.56,3.05 19.56,0.38 17.91,0.38
  pour Bottom (isolate 0.254, rank 2, no thermals): 17.91,3.05 19.56,3.05 19.56,0.38 17.91,0.38
SD_CD  (via drill 0.25)
  Top 0.152: U8.77 arc90 23.29,24.11 23.29,25.45 23.62,25.78 v23.62,26.04 | RN6.8 arc-90 RN6.8 arc90 RN6.8 | RN6.8 v29.59,31.93 31.06,31.93 32,30.99 34.42,30.99 34.92,31.49 U2.G$5
  Bottom 0.152: v23.62,26.04 25.15,27.56 28.7,27.56 30.61,29.46 30.61,31.24 29.92,31.93 v29.59,31.93
SDIO_CLK  (via drill 0.25)
  Top 0.152: U8.80 21.78,25.06 21.12,25.72 v21.12,26.02 | v30.23,26.04 31.16,26.04 U2.P$5
  Bottom 0.152: v30.23,26.04 24.84,26.04 24.2,25.4 21.74,25.4 v21.12,26.02
SDIO_CMD
  Top 0.152: U8.83 20.28,26.33 22.78,28.83 28.8,28.83 | U2.P$3 30.1,28.24 29.52,28.83 28.8,28.83 | RN6.5 28.84,28.87 28.8,28.83
SDIO_D0  (via drill 0.25)
  Top 0.152: RN5.6 arc-90 28.86,22.86 v29.59,22.86 30.57,23.84 U2.P$7 | U8.65 26.3,17.38 v26.42,17.27
  Bottom 0.152: v26.42,17.27 28.19,17.27 30.23,19.3 30.23,22.48 29.84,22.86 v29.59,22.86
SDIO_D1  (via drill 0.25)
  Top 0.152: RN5.5 arc-90 28.9,22.1 v29.59,22.1 29.97,22.1 30.62,22.74 U2.P$8 | U8.66 26.27,17.88 v26.42,18.03
  Top 0.203: 28.9,22.1 RN5.5
  Bottom 0.152: v26.42,18.03 28.19,18.03 29.59,19.43 v29.59,22.1
SDIO_D2  (via drill 0.25)
  Top 0.152: U8.78 arc-90 U8.78 v22.78,26.03 v22.78,26.04 | RN6.7 arc90 RN6.7 28.84,31.11 v29.59,31.11 29.97,31.11 30.64,30.44 U2.P$1
  Bottom 0.152: v22.78,26.04 25.02,28.27 28.52,28.27 30.1,29.84 30.1,30.86 29.84,31.11 v29.59,31.11
SDIO_D3  (via drill 0.25)
  Top 0.152: U8.79 arc-90 U8.79 22.28,25.48 21.97,25.78 v21.97,26.04 | RN6.6 arc-90 RN6.6 28.86,30.35 v29.59,30.35 30.6,29.34 U2.P$2
  Bottom 0.152: v21.97,26.04 21.97,26.16 24.66,28.85 28.09,28.85 v29.59,30.35
SPI2_MISO  (via drill 0.25)
  Top 0.152: U8.53 11.38,11.38 v11.18,11.18
  Bottom 0.152: v11.18,11.18 4.45,11.18 3.17,12.45 3.17,16.13 2.54,16.76 JP4.2
SPI2_MOSI  (via drill 0.25)
  Top 0.152: v11.18,12.06 24.64,12.06 24.82,11.88 U8.54
  Bottom 0.152: v11.18,12.06 4.83,12.06 3.81,13.08 3.81,18.29 2.79,19.3 JP4.1
SPI2_NSS
  Top 0.152: U8.51 12.29,10.38 9.14,7.24 3.94,7.24 3.05,8.13 3.05,11.18 2.54,11.68 JP4.4
SPI2_SCLK
  Top 0.152: U8.52 11.9,10.88 8.89,7.87 4.32,7.87 3.68,8.51 3.68,13.21 2.67,14.22 JP4.3
SWCLK  (via drill 0.25)
  Top 0.152: 23.81,24.13 U8.76
  Top 0.203: v24.38,24.13 23.81,24.13
  Bottom 0.203: JP3.1 32.77,20.45 32.77,22.99 30.35,25.4 25.65,25.4 v24.38,24.13
SWDIO
  Top 0.203: U8.72 26.74,20.88 29.96,17.66 33.01,17.66 JP3.2
TIM4_CH1  (via drill 0.25)
  Top 0.152: U8.59 26.13,14.38 26.29,14.22 v26.54,14.22
  Bottom 0.152: J3.3 29.46,6.6 28.7,7.37 28.7,12.95 27.43,14.22 v26.54,14.22
  Bottom 0.203: J3.3 JP3.6
TIM4_CH2  (via drill 0.25)
  Top 0.152: U8.60 26.06,14.88 26.29,15.11 v26.54,15.11
  Bottom 0.152: v26.54,15.11 28.45,15.11 28.96,14.61 J4.3 30.35,12.7 JP3.5
VBUS  (via drill 0.25, 0.33)
  Top 0.254: U8.68 26.38,18.88 v26.42,18.92
  Bottom 0.254: v21.97,5.33 23.75,7.11 23.75,12.32 22.99,13.08 22.99,16.26 25.65,18.92 v26.42,18.92
  pour Top (isolate 0.254, rank 2, no thermals): 22.73,6.99 22.73,3.3 21.34,3.3 21.34,1.96 20.07,1.96 20.07,5.21 21.59,5.21 21.59,6.99
VCAP1
  Top 0.254: U8.49 23.28,7.91 22.99,7.62 20.95,7.62 20.48,7.15 C49.1
VCAP2
  Top 0.305: U8.73 27.77,21.38 28.19,20.95 | 28.19,20.95 | 28.19,20.95 C48.1
VCC  (via drill 0.25, 0.33, 0.33 pad 0.61)
  Top 0.152: U5.E5 16.65,37.55 16.27,37.92 15.28,37.92
  Top 0.254: RN6.1 26.61,31.93 v26.42,32.13 | RN6.2 26.65,31.13 v26.42,31.37 | RN6.3 26.56,30.33 v26.42,30.48 | RN6.4 26.6,29.53 v26.42,29.72 | RN5.4 26.61,22.04 v26.54,21.97 | RN5.3 26.65,22.84 v26.54,22.73 | RN5.2 26.69,23.64 v26.54,23.5 | U8.28 12.78,7.54 13.25,7.07 C7.1 | 15.28,37.92 14.78,38.42 13.72,38.42 | RN7.3 v15,33.1
  Top 0.305: U8.75 25.53,22.41 v25.53,23.11 C9.1 | C7.1 v14.22,6.48 | U8.19 9.35,13.38 9.14,13.59 9.14,14.1 8.72,14.52 C14.1 v8.26,15.62 | U8.11 8.78,17.38 v8.26,17.91 C13.1 | U8.50 25.41,8.66 C8.1 v25.53,9.65 | 13.72,38.42 C19.1 | C20.1 11.9,38.3 | U8.6 10.98,19.88 v11.3,19.56 | RN7.4 RN7.3
  Top 0.406: U3.2 v4.95,8.51 | U6.2 v23.7,30.4 | v11,38.4 C20.1 C19.1
  other vias: 32.51,27.18 32.51,28.19 5.71,6.48 4.7,6.48 6.73,6.48 11.05,24.51 0.84,32.7 11.05,23.71 6.73,5.59 5.71,5.59 0.84,31.81 4.7,3.43 4.7,4.45 4.7,5.59 1.73,32.7
  pour VCC (isolate 0.305): 0.38,0.38 0.38,44.07 35.18,44.07 35.18,0.38
  pour Top (isolate 0.254, no thermals): 26.54,28.45 32.77,28.45 32.77,26.92 26.54,26.92
  pour Top (isolate 0.254, no thermals): 4.45,6.73 6.99,6.73 6.99,5.21 9.53,5.21 9.53,3.05 4.45,3.05
  pour Top (isolate 0.254, no thermals): 7.49,24.77 11.94,24.77 11.94,23.48 7.49,23.48
  pour Top (isolate 0.254, no thermals): 2.05,30.92 2.05,33 0.58,33 0.58,30.92
VIN
  pour Top (isolate 0.254, no thermals): 19.81,5.21 19.81,3.56 15.37,3.56 15.37,0.38 13.34,0.38 13.34,5.21

### Text on the board
tPlace: P0 | SWC | P1 | SWD | P2 | BOOT | P3 | RST | P4 | P8 | P5 | P7 | P6 | VCC | 3.3V | GND
bPlace: https://openmv.io | OpenMV Cam 2 | OV7725 - Rev 1 | LED1=Red | 2/9/2016 | LED2=Green | LED3=Blue | LED4=IR | Built by MacroFab | Made in USA | Pin List | P0=PB15/MOSI | P0 | P1=PB14/MISO | P2=PB13/SCLK | SWC | P1 | P3=PB12/SS | SWD | P4=PB10/TXD/SCL | P8 | P2 | P5=PB11/RXD/SDA | P6=PA5/ADC/DAC | BOOT | P7=PD12/SERVO1 | P3 | P8=PD13/SERVO2 | RST | P4 | P8 | Max voltage: 5v | P7 | P5 | P7 | P6 | VCC | 3.3V | GND